# Altium schematic sheet PainRegister_Power.SchDoc
size 420 x 297 mm; DocumentNumber: СКТБ.411126.001 Э3; SheetNumber: 2; Format: A3
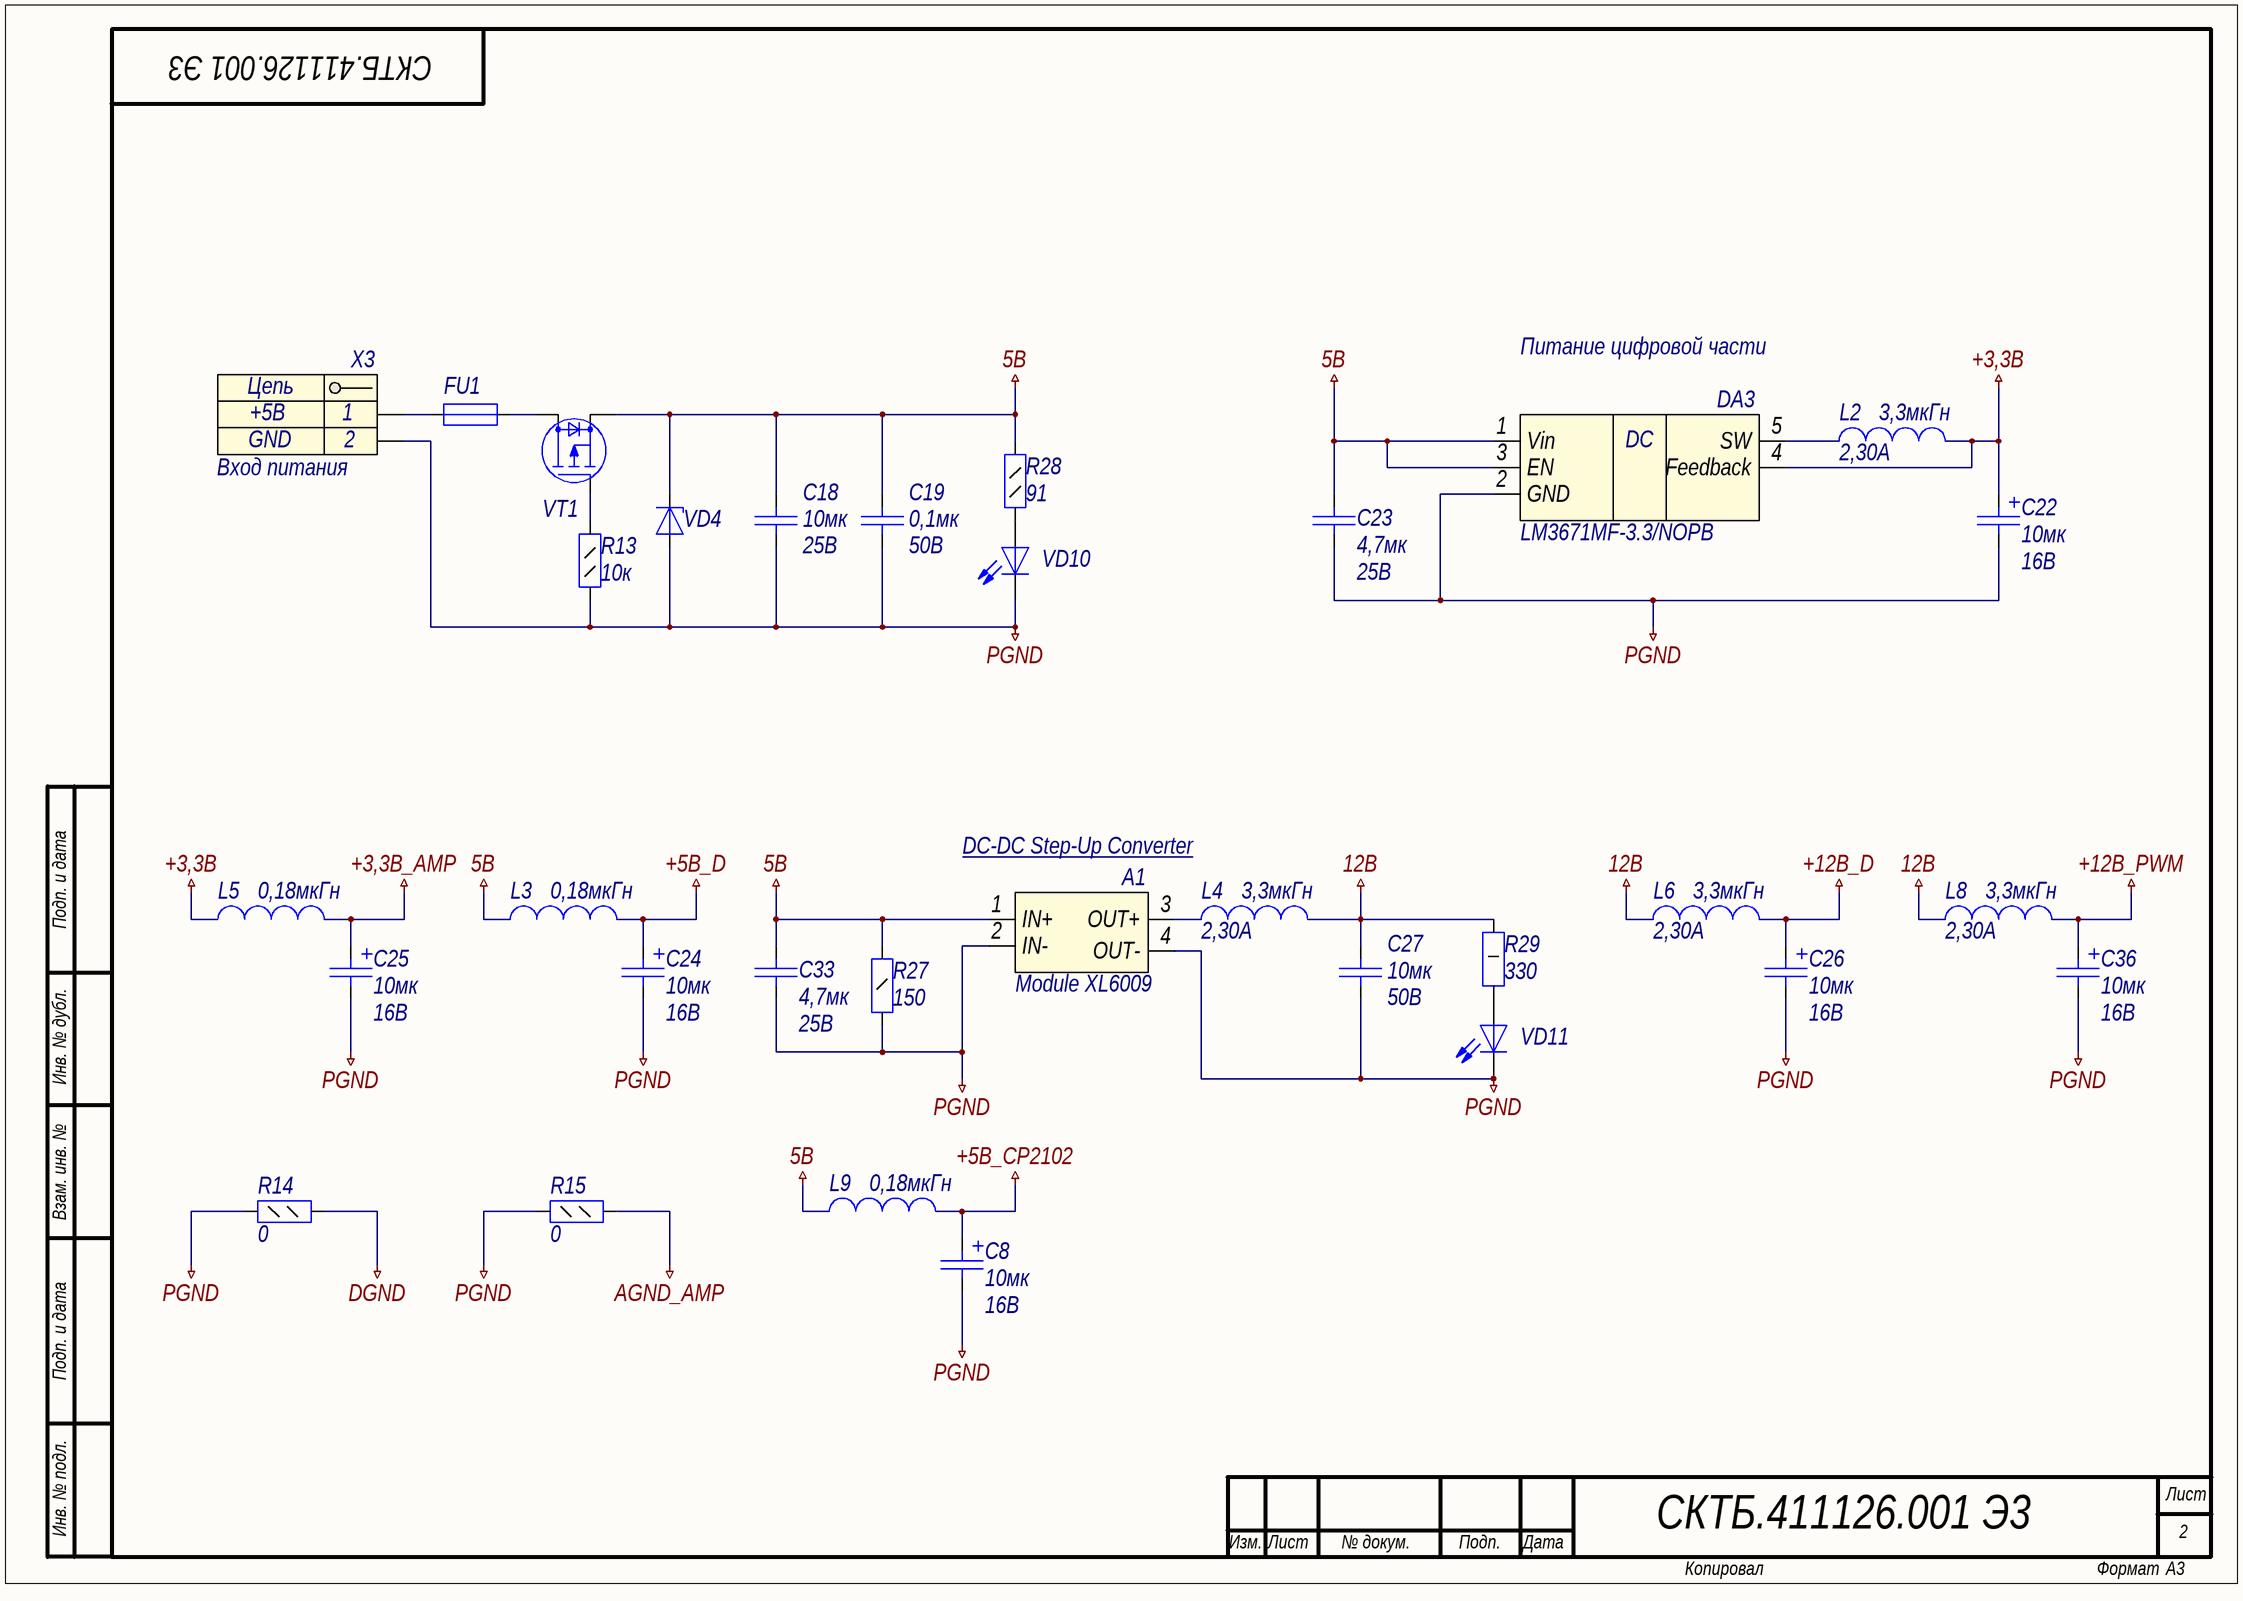
[diagram p0: PainRegister_Power.SchDoc]

## Parts
A1  Module XL6009  [Module XL6009]
C8  value 10мк  Voltage: 16В  [TANTAL CASE A]  (hidden comment: Capacitor_pol)
C18  value 10мк  Voltage: 25В  [C1206]  (hidden comment: Capacitor)
C19  value 0,1мк  Voltage: 50В  [C0805]  (hidden comment: Capacitor)
C22  value 10мк  Voltage: 16В  [TANTAL CASE A]  (hidden comment: Capacitor_pol)
C23  value 4,7мк  Voltage: 25B  [C0805]  (hidden comment: Capacitor)
C24  value 10мк  Voltage: 16В  [TANTAL CASE A]  (hidden comment: Capacitor_pol)
C25  value 10мк  Voltage: 16В  [TANTAL CASE A]  (hidden comment: Capacitor_pol)
C26  value 10мк  Voltage: 16В  [TANTAL CASE A]  (hidden comment: Capacitor_pol)
C27  value 10мк  Voltage: 50В  [C1210]  (hidden comment: Capacitor)
C33  value 4,7мк  Voltage: 25B  [C0805]  (hidden comment: Capacitor)
C36  value 10мк  Voltage: 16В  [TANTAL CASE A]  (hidden comment: Capacitor_pol)
DA3  Part Number: LM3671MF-3.3/NOPB  [SOT23-5]  (hidden comment: LM3671MF)
FU1  Fuse  [FUSE812]  (value not drawn)
L2  value 3,3мкГн  Rated Current: 2,30А  [SRR0604]  (hidden comment: Inductor)
L3  value 0,18мкГн  [L0805]  (hidden comment: Inductor)
L4  value 3,3мкГн  Rated Current: 2,30А  [SRR0604]  (hidden comment: Inductor)
L5  value 0,18мкГн  [L0805]  (hidden comment: Inductor)
L6  value 3,3мкГн  Rated Current: 2,30А  [SRR0604]  (hidden comment: Inductor)
L8  value 3,3мкГн  Rated Current: 2,30А  [SRR0604]  (hidden comment: Inductor)
L9  value 0,18мкГн  [L0805]  (hidden comment: Inductor)
R13  value 10к  [R0805]  (hidden comment: Resistor_0,125Вт)
R14  value 0  [R0805]  (hidden comment: Resistor_0,125Вт)
R15  value 0  [R0805]  (hidden comment: Resistor_0,125Вт)
R27  value 150  [R1206]  (hidden comment: Resistor_0,25Вт)
R28  value 91  [R0805]  (hidden comment: Resistor_0,125Вт)
R29  value 330  [R2512]  (hidden comment: Resistor_1Вт)
VD4  DiodeZener  [SMA]  (value not drawn)
VD10  LED  [L_0805]  (value not drawn)
VD11  LED  [L_0805]  (value not drawn)
VT1  P-MOSFET  [SOT23-3]  (value not drawn)
X3  Вход питания  [TERMINAL-2WAY-3.5MM]

## Nets
5B: A1.1(IN+) C18.2 C19.2 C23.2 C33.2 DA3.1(Vin) DA3.3(EN) L3.1 L9.1 R27.2 R28.2 VD4.1(K) VT1.3(S)
12В: C27.2 L4.2 L6.1 L8.1 R29.2
+3,3В: C22.1 DA3.4(Feedback) L2.2 L5.1
+3,3В_AMP: C25.1 L5.2
+5B_CP2102: C8.1 L9.2
+5B_D: C24.1 L3.2
+12В_D: C26.1 L6.2
+12В_PWM: C36.1 L8.2
AGND_AMP: R15.2
DGND: R14.2
PGND: A1.2(IN-) A1.4(OUT-) C8.2 C18.1 C19.1 C22.2 C23.1 C24.2 C25.2 C26.2 C27.1 C33.1 C36.2 DA3.2(GND) R13.1 R14.1 R15.1 R27.1 VD4.2(A) VD10.1(K) VD11.1(K) X3.2
NetA1_3: A1.3(OUT+) L4.1
NetDA3_5: DA3.5(SW) L2.1
NetFU1_1: FU1.1 X3.1
NetFU1_2: FU1.2 VT1.2(D)
NetR13_2: R13.2 VT1.1(G)
NetR28_1: R28.1 VD10.2(A)
NetR29_1: R29.1 VD11.2(A)

## Notes on the sheet
- Питание цифровой части
- DC-DC Step-Up Converter
- Подп. и дата
- Инв. № дубл.
- Взам. инв. №
- Инв. № подл.
- Лист
- Изм.
- № докум.
- Подп.
- Дата
- Копировал
- Формат
- (in symbol connect34) Цепь
- (in symbol pwr2) DC

## Library data of the parts
A1 = module4: DC-DC step-up converter for 5/32-V to 5/35-V; Part Name: XL6009E1; id: module4
C8 C22 C24-C26 C36 = cap199: Конденсатор полярный; Part Name: Tantal; Manufacture: Vishay; Part Number: 293D106X9016A2TE3; id: cap199
C18 = cap186: Конденсатор; Part Name: Ceramic; Manufacture: Murata; Part Number: GRM31CR71E106KA12L*; id: cap186; TKE: X7R
C19 = cap160: Конденсатор; Part Name: Ceramic; Manufacture: Murata; Part Number: GRM21BR71H104KA01L; id: cap160; TKE: X7R
C23 C33 = cap153: Конденсатор; Part Name: Ceramic; Manufacture: Murata; Part Number: GRM21BR61E475KA12L; id: cap153; TKE: X5R
C27 = cap205: Конденсатор; Part Name: Ceramic; Manufacture: Murata; Part Number: GRM32ER71H106K; id: cap205; TKE: X7R
DA3 = pwr2: Step-Down DC-DC Converter; Part Name: 600-mA Step-Down DC-DC Converter; Manufacturer: Texas Instruments; id: pwr2; Input Voltage: 2,7 - 5,5B; Output Voltage: 3,3B; Current: 0,6A; Type: Impulse
FU1 = fuse15: Предохранитель; Part Name: Resettable Fuses; Manufacture: Bourns; Part Number: MF-MSMF260; id: fuse15; V max: 6B; I max: 100A; I hold: 2,6A; I trip: 5,2A; Resistance: 0,015Ohms
L2 L4 L6 L8 = ind138: EMI Suppression Filter; Part Name: SMD Power Inductors; Part Number: SRR0604-3R3ML; Manufacture: Bourns; id: ind138; Saturation Current: 2,90А; Resistance: 0,050Ohm
L3 L5 L9 = ind2: EMI Suppression Filter; Part Number: CM201212-R18KL; Rated Current: 120-540мА; id: ind2; Part Name: Inductor
R13 = res97: Резистор; Manufacture: Yageo; Part Number: RC0805FR-0710KL; id: res97; Accuracy: 0.01; Part Name: Resistor; Power: 0,125Вт
R14 R15 = res0: Резистор; Manufacture: Yageo; Part Number: RC0805FR-070RL; id: res0; Accuracy: 0.01; Part Name: Resistor; Power: 0,125Вт
R27 = res632: Резистор; Manufacture: Yageo; Part Number: RC1206FR-07150RL; id: res632; Accuracy: 0.01; Power: 0,25Вт; Part Name: Resistor
R28 = res48: Резистор; Manufacture: Yageo; Part Number: RC0805FR-0791RL; id: res48; Accuracy: 0.01; Part Name: Resistor; Power: 0,125Вт
R29 = res833: Резистор; Manufacture: Yageo; Part Number: RC2512FR-07330RL; id: res833; Accuracy: 0.01; Power: 1Вт; Part Name: Resistor
VD4 = SMAJ5.0A: Cтабилитрон (лавинный выпрямительный диод) односторонний; Part Name: TVS diode Unidirectional; Manufacture: ST Microelectronics; id: tvs123; Leakage Current: 20uA; Stand-off Voltage: 5B; Breakdown Voltage: 6,74B; Clamping voltage: 9,2B; Dynamic resistance: 0,049Ohm; Peak Pulse Power: 400W; Number of diodes: 1; Part Number: SMAJ5.0A
VD10 VD11 = diode5: Светодиод; Part Number: KP-2012EC; id: diode5; Part Name: LED
VT1 = trans11: N-MOSFET; Part Number: IRLML6401TRPBF; Manufacturer: International Rectifier; Structure: p-channel; V drain-source max: (-12B); Rds: 0,05Ohm; Gate-to-source voltage: (+-)8B; Continuous drain current: 4,3A; Pulsed drain current: 34A; Power dissipation: 1,3W; id: trans11
X3 = connect34: Разъем - 2 конт. клеммник; Part Name: TERMINAL BLOCK 2 way; Contact_1: +5В; Contact_2: GND; Etch: 3.5mm; id: connect34